# EAGLE design BrickPi 0.5 (EAGLE 6.3)
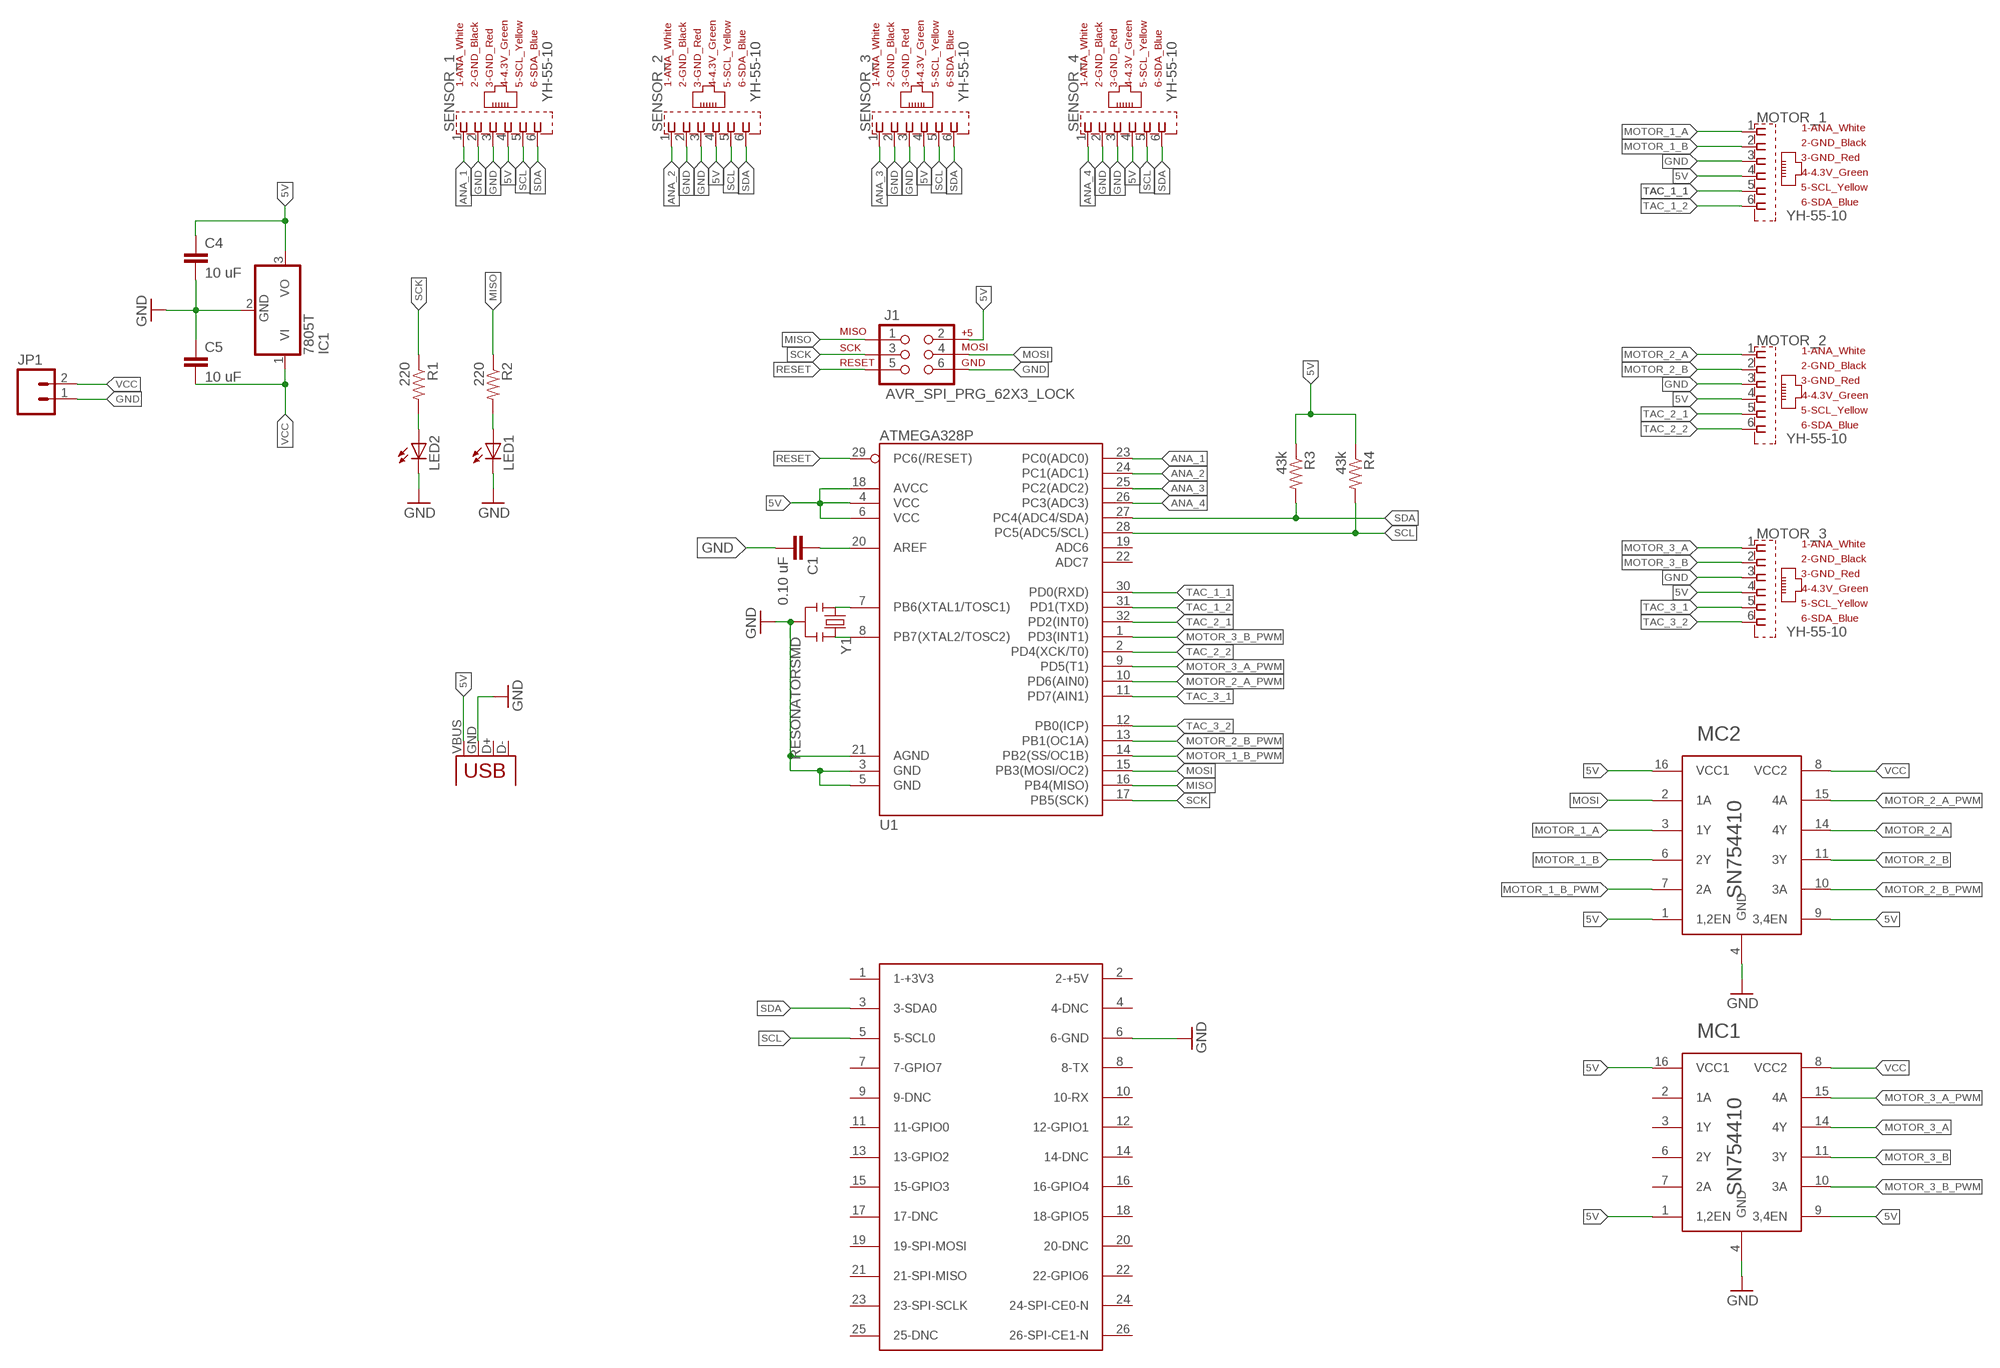
[diagram p0: schematic, sheet 1]

## Parts
C1  0.10 uF  CAP0805  [0805]
C4  10 uF  CAP0805  [0805]
C5  10 uF  CAP0805  [0805]
IC1  7805T  [TO220H]
J1  AVR_SPI_PRG_62X3_LOCK  [2X3_LOCK]
JP1  M02LOCK  [1X02_LOCK]
JP2  USB-A-H  [USB-A-H]
LED1  LED1206  [LED-1206]
LED2  LED1206  [LED-1206]
MC1  SN754410  [DIL16]
MC2  SN754410  [DIL16]
MOTOR_1  YH-55-10  [YH-55-10]
MOTOR_2  YH-55-10  [YH-55-10]
MOTOR_3  YH-55-10  [YH-55-10]
PI_OUTLINE  RASPBERRY-PI  [RASPBERRY-PI]
R1  220  220-5%  [0603-RES]
R2  220  220-5%  [0603-RES]
R3  43k  220-5%  [0603-RES]
R4  43k  220-5%  [0603-RES]
SENSOR_1  YH-55-10  [YH-55-10]
SENSOR_2  YH-55-10  [YH-55-10]
SENSOR_3  YH-55-10  [YH-55-10]
SENSOR_4  YH-55-10  [YH-55-10]
U1  ATMEGA328P  ATMEGA328_SMT  [TQFP32-08]
Y1  RESONATORSMD  [RESONATOR-SMD]

## Nets
5V [Logic_Power]: C4.1 IC1.3(VO) J1.2 JP2.VBUS(GND) MC1.1(1,2EN) MC1.9(3,4EN) MC1.16(VCC1) MC2.1(1,2EN) MC2.9(3,4EN) MC2.16(VCC1) MOTOR_1.4(4_4.3V_GREEN) MOTOR_2.4(4_4.3V_GREEN) MOTOR_3.4(4_4.3V_GREEN) R3.1 R4.1 SENSOR_1.4(4_4.3V_GREEN) SENSOR_2.4(4_4.3V_GREEN) SENSOR_3.4(4_4.3V_GREEN) SENSOR_4.4(4_4.3V_GREEN) U1.4(VCC) U1.6(VCC) U1.18(AVCC)
ANA_1: SENSOR_1.1(1_ANA_WHITE) U1.23(PC0(ADC0))
ANA_2: SENSOR_2.1(1_ANA_WHITE) U1.24(PC1(ADC1))
ANA_3: SENSOR_3.1(1_ANA_WHITE) U1.25(PC2(ADC2))
ANA_4: SENSOR_4.1(1_ANA_WHITE) U1.26(PC3(ADC3))
GND [Power]: C1.2 C4.2 C5.1 IC1.2(GND) J1.6 JP1.1 JP2.GND(VBUS) LED1.C LED2.C MC1.4(GND) MC2.4(GND) MOTOR_1.3(3_GND_RED) MOTOR_2.3(3_GND_RED) MOTOR_3.3(3_GND_RED) PI_OUTLINE.6(6-GND) SENSOR_1.2(2_GND_BLACK) SENSOR_1.3(3_GND_RED) SENSOR_2.2(2_GND_BLACK) SENSOR_2.3(3_GND_RED) SENSOR_3.2(2_GND_BLACK) SENSOR_3.3(3_GND_RED) SENSOR_4.2(2_GND_BLACK) SENSOR_4.3(3_GND_RED) U1.3(GND) U1.5(GND) U1.21(AGND) Y1.2
MISO: J1.1 R2.1 U1.16(PB4(MISO))
MOSI: J1.4 MC2.2(1A) U1.15(PB3(MOSI/OC2))
MOTOR_1_A [Power]: MC2.3(1Y) MOTOR_1.1(1_ANA_WHITE)
MOTOR_1_B [Power]: MC2.6(2Y) MOTOR_1.2(2_GND_BLACK)
MOTOR_1_B_PWM: MC2.7(2A) U1.14(PB2(SS/OC1B))
MOTOR_2_A [Power]: MC2.14(4Y) MOTOR_2.1(1_ANA_WHITE)
MOTOR_2_A_PWM: MC2.15(4A) U1.10(PD6(AIN0))
MOTOR_2_B [Power]: MC2.11(3Y) MOTOR_2.2(2_GND_BLACK)
MOTOR_2_B_PWM: MC2.10(3A) U1.13(PB1(OC1A))
MOTOR_3_A [Power]: MC1.14(4Y) MOTOR_3.1(1_ANA_WHITE)
MOTOR_3_A_PWM: MC1.15(4A) U1.9(PD5(T1))
MOTOR_3_B [Power]: MC1.11(3Y) MOTOR_3.2(2_GND_BLACK)
MOTOR_3_B_PWM: MC1.10(3A) U1.1(PD3(INT1))
N$1: U1.7(PB6(XTAL1/TOSC1)) Y1.1
N$2: U1.8(PB7(XTAL2/TOSC2)) Y1.3
N$3: LED2.A R1.2
N$4: LED1.A R2.2
N$6 [Logic_Power]: C1.1 U1.20(AREF)
RESET: J1.5 U1.29(PC6(/RESET))
SCK: J1.3 R1.1 U1.17(PB5(SCK))
SCL: PI_OUTLINE.5(5-SCL0) R4.2 SENSOR_1.5(5_SCL_YELLOW) SENSOR_2.5(5_SCL_YELLOW) SENSOR_3.5(5_SCL_YELLOW) SENSOR_4.5(5_SCL_YELLOW) U1.28(PC5(ADC5/SCL))
SDA: PI_OUTLINE.3(3-SDA0) R3.2 SENSOR_1.6(6_SDA_BLUE) SENSOR_2.6(6_SDA_BLUE) SENSOR_3.6(6_SDA_BLUE) SENSOR_4.6(6_SDA_BLUE) U1.27(PC4(ADC4/SDA))
TAC_1_1: MOTOR_1.5(5_SCL_YELLOW) U1.30(PD0(RXD))
TAC_1_2: MOTOR_1.6(6_SDA_BLUE) U1.31(PD1(TXD))
TAC_2_1: MOTOR_2.5(5_SCL_YELLOW) U1.32(PD2(INT0))
TAC_2_2: MOTOR_2.6(6_SDA_BLUE) U1.2(PD4(XCK/T0))
TAC_3_1: MOTOR_3.5(5_SCL_YELLOW) U1.11(PD7(AIN1))
TAC_3_2: MOTOR_3.6(6_SDA_BLUE) U1.12(PB0(ICP))
VCC [Power]: C5.2 IC1.1(VI) JP1.2 MC1.8(VCC2) MC2.8(VCC2)
Unconnected: JP2.D+(D-) JP2.D-(D+) MC1.2(1A) MC1.3(1Y) MC1.6(2Y) MC1.7(2A) PI_OUTLINE.1(1-+3V3) PI_OUTLINE.2(2-+5V) PI_OUTLINE.4(4-DNC) PI_OUTLINE.7(7-GPIO7) PI_OUTLINE.8(8-TX) PI_OUTLINE.9(9-DNC) PI_OUTLINE.10(10-RX) PI_OUTLINE.11(11-GPIO0) PI_OUTLINE.12(12-GPIO1) PI_OUTLINE.13(13-GPIO2) PI_OUTLINE.14(14-DNC) PI_OUTLINE.15(15-GPIO3) PI_OUTLINE.16(16-GPIO4) PI_OUTLINE.17(17-DNC) PI_OUTLINE.18(18-GPIO5) PI_OUTLINE.19(19-SPI-MOSI) PI_OUTLINE.20(20-DNC) PI_OUTLINE.21(21-SPI-MISO) PI_OUTLINE.22(22-GPIO6) PI_OUTLINE.23(23-SPI-SCLK) PI_OUTLINE.24(24-SPI-CE0-N) PI_OUTLINE.25(25-DNC) PI_OUTLINE.26(26-SPI-CE1-N) U1.19(ADC6) U1.22(ADC7)

## Power pins joined to a net without a drawn wire
GND: MC1.5(GND) MC1.12(GND) MC1.13(GND) MC2.5(GND) MC2.12(GND) MC2.13(GND)

## Library data of the parts
C1 C4 C5 = SparkFun:CAP: Capacitor Standard 0603 ceramic capacitor, and 0.1" leaded capacitor.
IC1 = linear:78*: Positive VOLTAGE REGULATOR Source: http://cache.national.com/ds/LM/LM78L05.pdf http://www.fairchildsemi.com/ds/LM/LM7805.pdf
J1 = SparkFun-Connectors:AVR_SPI_PRG_6: AVR ISP 6 Pin This is the reduced ISP connector for AVR programming. Common on Arduino. This footprint will take up less PCB space and can be used with a 10-pin to 6-pin adapter such as SKU: BOB-08508
JP1 = SparkFun-f115009:M02: Header 2 Standard 2-pin 0.1" header. Use with straight break away headers (SKU : PRT-00116), right angle break away headers (PRT-00553), swiss pins (PRT-00743), machine pins (PRT-00117), and female headers (PRT-00115). Molex polarized connector foot print use with SKU : PRT-08233 with associated crimp pins and housings.
JP2 = SparkFun-Connectors:USB: USB Connectors USB-B-PTH is fully proven SKU : PRT-00139/CONN-08278 USB-miniB is fully proven SKU : PRT-00587 USB-A-PCB is untested. USB-A-H is throughly reviewed, but untested. Spark Fun Electronics SKU : PRT-00437 USB-B-SMT is throughly reviewed, but untested. Needs silkscreen touching up. USB-A-S has not been used/tested USB-MB-H has not been used/tested USB-MICROB has been used. CONN-09505
LED1 LED2 = SparkFun-LED:LED: LEDs Standard schematic elements and footprints for 5mm, 3mm, 1206, and 0603 sized LEDs. 5mm - Spark Fun Electronics SKU : COM-00529 (and others)
MC1 MC2 = DualBridge:SN754410: Quad Half-Bridge Driver
MOTOR_1-MOTOR_3 SENSOR_1-SENSOR_4 = DEXTER INDUSTRIES NXT Female Adapter (2!!):YH-55-10: RJ11 6 connects Source:Dexter Industries LEGO MINDSTORMS NXT Female Adapter; OC_FARNELL: unknown; OC_NEWARK: unknown
PI_OUTLINE = RaspberryPi:RASPBERRY-PI: Raspberry Pi Board <http://www.raspberrypi.org/> Jacques Lagnel V1.0 (beta) 2012 Board dimension: Forum 3D model <http://www.raspberrypi.org/forum/general-discussion/mechanical-profile-3d-models?value=3d%20model&type=1&include=1&search=1&ret=all> The GPIO Connector (P1): http://elinux.org/RPi_Low-level_peripherals
R1 R2 = SparkFun-Resistors:220-5%: 220-ohm SMT 1/8W - 5% (0805) RES-07866; PROD_ID: RES-07866
R3 R4 = SparkFun-Resistors:220-5%: 220-ohm SMT 1/8W - 5% (0805) RES-07866; PROD_ID: RES-07866; VALUE: 220
U1 = SparkFun-DigitalIC:ATMEGA328_SMT: 32-Pin Atmega328 part Commonly used on Arduino compatible boards Available in QFP and QFN packages TQFP is IC-09069 QFN is non-stock; PROD_ID: IC-09069
Y1 = SparkFun-f115009:RESONATOR: Resonator Small SMD resonator. This is the itty bitty 10/20MHz resonators with built in caps. CSTCE10M0G55 and CSTCE20M0V53. Footprint has been reviewed closely but hasn't been tested yet.

## Net classes
0 DATA: width 0.254 mm, drill 0.5 mm, clearance 0.152 mm
1 Power: width 0.508 mm, drill 0.6 mm, clearance 0.152 mm
2 Logic_Power: width 0.381 mm, drill 0.6 mm, clearance 0.152 mm

## Board
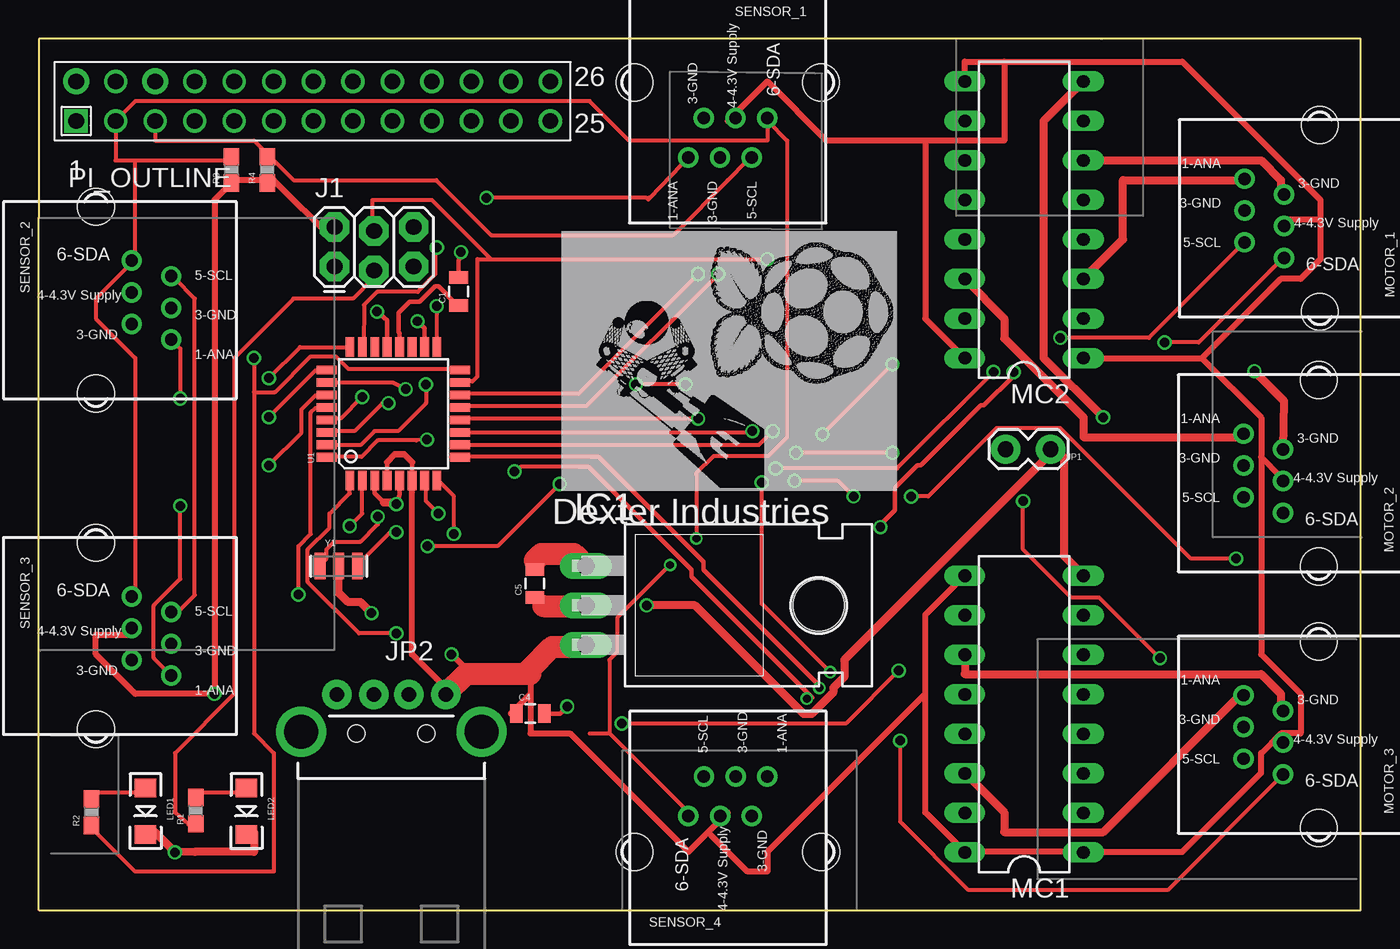
[diagram p1: board, top side]
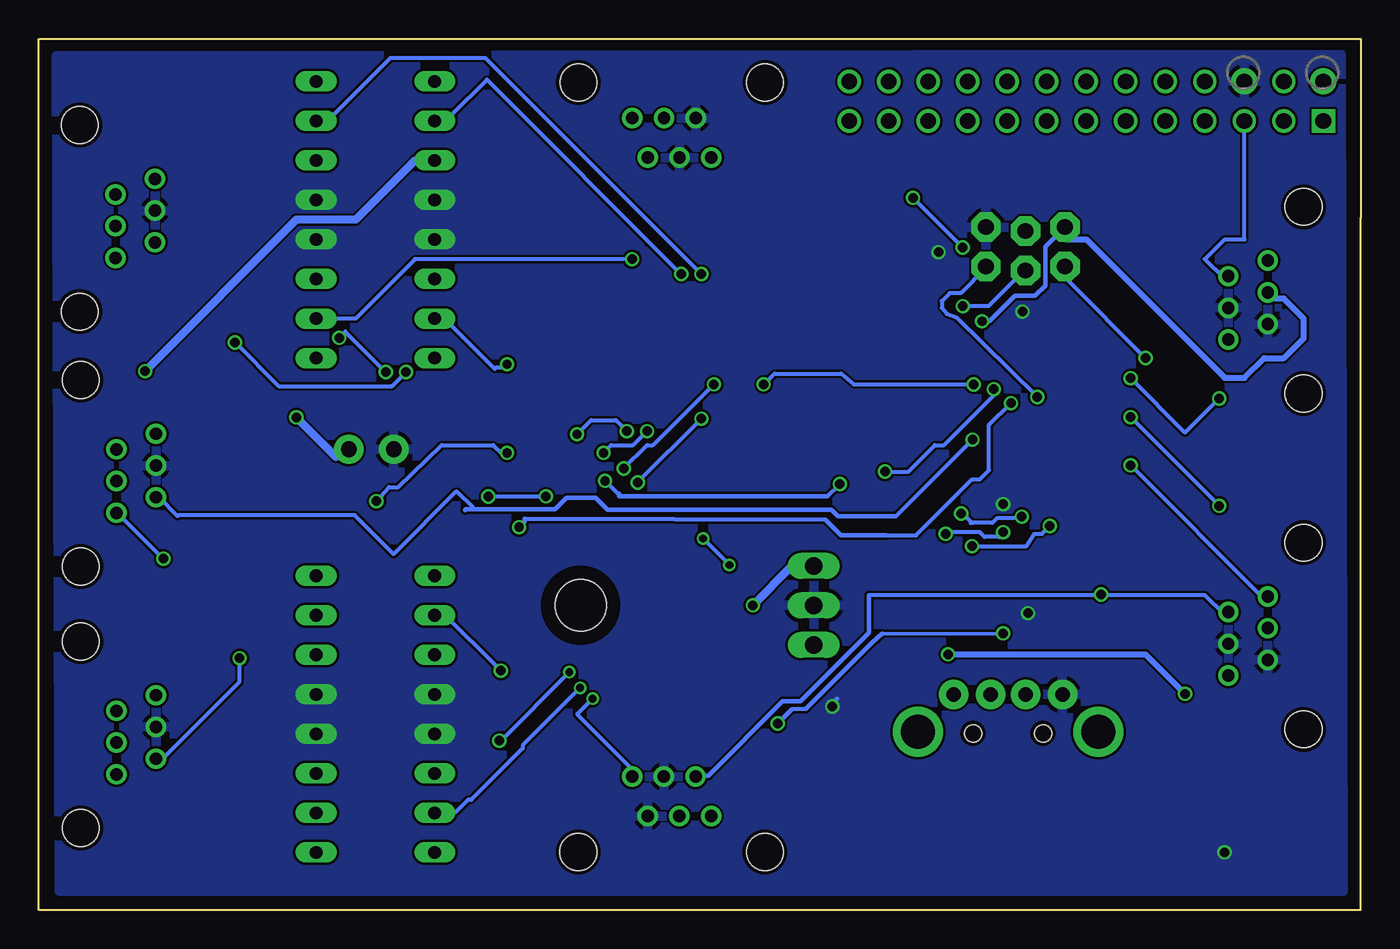
[diagram p2: board, bottom side, seen from below]

Size 85 x 56 mm. Coordinates in mm from the lower left corner, seen from the top.
Copper layers (1*16): Top 0.035mm / dielectric 1.5mm / Bottom 0.035mm
Design rules "Fusion_eagle_rule_v1.1": minimum track width 6mil, minimum drill 12mil, track to track 6mil, track to pad 6mil, pad to pad 6mil, via to via 6mil, smd to smd 0mil, copper to edge 10mil, drill to drill 10mil, minimum pad ring 10mil, minimum via ring 6mil, stop-mask expansion 2mil, vias tented up to drill 100mil, thermal gap 10mil

### Footprints (pad centres in the part's own frame; a part is rotated, then mirrored left to right if it is on the bottom)
0805 = smd 0.8 x 1.2: 1 -0.9,0; 2 0.9,0
TO220H = drill 1.118 long: 1 -2.54,-10.16; 2 0,-10.16; 3 2.54,-10.16 | hole 3.302: 0,4.826
2X3_LOCK = drill 1.016 pad 1.88 octagon: 1 0,0; 2 0,2.54; 3 2.54,-0.254; 4 2.54,2.286; 5 5.08,0; 6 5.08,2.54
1X02_LOCK = drill 1.016 pad 1.88: 1 -0.178,0; 2 2.718,0
USB-A-H = drill 0.914 pad 1.88: D+ 2.4,1.127; D- 2.4,-1.127; GND 2.4,3.5; VBUS 2.4,-3.5 | drill 2.2: GND2 0,-5.8; GND3 0,5.8 | hole 1.1: -0.1,2.25; -0.1,-2.25
LED-1206 = smd 1.2 x 1.4: A -1.5,0; C 1.5,0
DIL16 = drill 0.813 long: 1 -8.89,-3.81; 2 -6.35,-3.81; 3 -3.81,-3.81; 4 -1.27,-3.81; 5 1.27,-3.81; 6 3.81,-3.81; 7 6.35,-3.81; 8 8.89,-3.81; 9 8.89,3.81; 10 6.35,3.81; 11 3.81,3.81; 12 1.27,3.81; 13 -1.27,3.81; 14 -3.81,3.81; 15 -6.35,3.81; 16 -8.89,3.81
YH-55-10 = drill 0.8 pad 1.3: 1 2.54,4.84; 2 1.54,2.3; 3 0.5,4.84; 4 -0.5,2.3; 5 -1.54,4.84; 6 -2.54,2.3 | hole 2.36: -6,0; 6,0
RASPBERRY-PI = drill 1 square: 1 0,0 | drill 1 pad 1.676: 2 0,2.54; 6 5.08,2.54 | drill 1: 3 2.54,0; 4 2.54,2.54; 5 5.08,0; 7 7.62,0; 8 7.62,2.54; 9 10.16,0; 10 10.16,2.54; 11 12.7,0; 12 12.7,2.54; 13 15.24,0; 14 15.24,2.54; 15 17.78,0; 16 17.78,2.54; 17 20.32,0; 18 20.32,2.54; 19 22.86,0; 20 22.86,2.54; 21 25.4,0; 22 25.4,2.54; 23 27.94,0; 24 27.94,2.54; 25 30.48,0; 26 30.48,2.54
0603-RES = smd 1.1 x 1: 1 -0.85,0; 2 0.85,0
TQFP32-08 = smd 1.27 x 0.559: 1 -4.293,2.8; 2 -4.293,2; 3 -4.293,1.2; 4 -4.293,0.4; 5 -4.293,-0.4; 6 -4.293,-1.2; 7 -4.293,-2; 8 -4.293,-2.8; 17 4.293,-2.8; 18 4.293,-2; 19 4.293,-1.2; 20 4.293,-0.4; 21 4.293,0.4; 22 4.293,1.2; 23 4.293,2; 24 4.293,2.8 | smd 0.559 x 1.27: 9 -2.8,-4.293; 10 -2,-4.293; 11 -1.2,-4.293; 12 -0.4,-4.293; 13 0.4,-4.293; 14 1.2,-4.293; 15 2,-4.293; 16 2.8,-4.293; 25 2.8,4.293; 26 2,4.293; 27 1.2,4.293; 28 0.4,4.293; 29 -0.4,4.293; 30 -1.2,4.293; 31 -2,4.293; 32 -2.8,4.293
RESONATOR-SMD = smd 0.7 x 1.7: 1 -1.2,0; 2 0,0; 3 1.2,0

### Placement (x,y rotation side)
C1  26.99,39.75 90 top
C4  31.61,12.62 0 top
C5  31.89,20.98 90 top
IC1  45.33,19.58 270 top
J1  19.01,41.36 0 top
JP1  62.35,29.62 0 top
JP2  22.67,11.46 90 top
LED1  6.86,6.34 270 top
LED2  13.35,6.34 270 top
MC1  63.36,12.59 90 top
MC2  63.36,44.38 90 top
MOTOR_1  82.37,44.46 90 top
MOTOR_2  82.31,28.07 90 top
MOTOR_3  82.31,11.26 90 top
PI_OUTLINE  2.4,50.73 0 top
R1  10.09,6.38 90 top
R2  3.39,6.28 90 top
R3  12.39,47.59 90 top
R4  14.69,47.59 90 top
SENSOR_1  44.3,53.2 180 top
SENSOR_2  3.67,39.2 270 top
SENSOR_3  3.67,17.61 270 top
SENSOR_4  44.31,3.73 0 top
U1  22.8,31.91 90 top
Y1  19.28,22.1 0 top

### Tracks (layer width: path | path; a pad name or v marks a point on that pad's centre or on a via)
5V  (via drill 0.6, 0.61)
  Top 0.305: U1.4 22.39,28.78 | 23.99,28.78 U1.6 | U1.18 24.8,37.39 v24.35,37.85
  Top 0.381: 15.1,46.91 12.56,46.91 | 15.1,46.91 18.91,43.1 J1.2 | 15.1,46.91 R4.1 | 12.56,46.91 11.29,45.64 v11.29,13.89 6.21,13.89 3.67,16.43 3.67,17.7 6.21,17.7 SENSOR_3.4 | 12.56,46.91 R3.1 | U1.6 23.99,27.86 23.99,16.43 26.53,13.89 JP2.VBUS | 31.61,13.89 30.34,12.62 C4.1 | 31.61,15.16 31.61,13.89 | 43.04,5 41.77,3.73 34.15,11.35 31.61,11.35 31.61,13.89 | 43.04,5 44.31,6.27 SENSOR_4.4 | 79.87,11.35 78.6,10.08 78.6,8.81 73.52,3.73 67.17,3.73 | 67.17,3.73 59.55,3.73 | 67.17,3.73 MC1.1 | 57.01,13.89 57.01,6.27 59.55,3.73 | 57.01,13.89 57.01,18.97 59.55,21.51 MC1.9 | 59.55,3.73 MC1.16 | 78.6,29.13 79.87,27.86 MOTOR_2.4 | 78.6,29.13 78.6,31.67 74.79,35.48 | MC2.1 74.79,35.48 | 82.41,44.38 79.87,44.38 MOTOR_1.4 | 82.41,44.38 82.41,45.64 73.52,54.53 62.09,54.53 | 62.09,54.53 59.55,54.53 MC2.9 | 57.01,49.45 62.09,49.45 62.09,54.53 | 57.01,49.45 50.66,49.45 46.85,53.27 44.31,50.73 SENSOR_1.4 | MC2.16 57.01,38.02 57.01,49.45 | 74.79,35.48 79.87,40.56 81.14,40.56 82.41,41.84 82.41,44.38 | 79.87,11.35 81.14,11.35 81.14,13.89 78.6,16.43 78.6,29.13 | 79.87,11.35 MOTOR_3.4 | 43.04,5 45.58,2.46 46.85,2.46 46.85,3.73 57.01,13.89
  Top 0.406: U1.4 | 22.39,28.78 22.89,29.28 23.49,29.28 23.99,28.78 | U1.6 | v26.53,16.43 26.55,16.43 27.82,15.16
  Top 1.422: IC1.3 35.04,16.92 33.01,16.92 31.61,15.52 31.61,15.16 27.82,15.16 27.48,15.16 JP2.VBUS
  Bottom 0.305: v24.35,37.85 23.86,37.85 22.24,39.47 20.94,39.47 20.28,40.13 20.28,42.63 J1.2
  Bottom 0.381: SENSOR_2.4 6.21,39.29 4.94,39.29 3.67,38.02 3.67,36.75 4.94,35.48 6.21,35.48 7.48,34.21 8.75,34.21 17.64,43.1 18.91,43.1 J1.2 | 26.53,13.89 JP2.VBUS | v11.29,13.89 13.83,16.43 v26.53,16.43
ANA_1  (via drill 0.61)
  Top 0.254: v25.59,42.59 25.49,42.48 25.49,40.88 24.37,39.74 21.75,39.74 20.91,38.9 20.89,36.28 U1.23 | v28.79,45.78 39.09,45.78 39.19,45.68 39.19,45.78 39.29,45.78 41.29,47.88 41.69,48.28 SENSOR_1.1
  Bottom 0.254: v28.79,45.78 v25.59,42.59
ANA_2  (via drill 0.61)
  Top 0.254: v14.79,34.18 16.79,36.18 U1.24 | v9.09,32.88 9.09,36.09 SENSOR_2.1
  Bottom 0.254: v14.79,34.18 11.29,30.68 v9.09,32.88
ANA_3  (via drill 0.61)
  Top 0.254: v14.79,31.68 17.79,34.68 18.49,34.68 U1.25 | v9.09,25.98 9.09,21.28 7.39,19.58 7.39,16.18 8.49,15.08 SENSOR_3.1
  Bottom 0.254: v9.09,25.98 v14.79,31.68
ANA_4  (via drill 0.5, 0.61)
  Top 0.254: v23.59,33.48 22.79,33.88 18.59,33.88 U1.26 | 34.69,28.48 30.99,28.48 v30.59,28.18 | v49.39,13.58 49.6,13.79
  Top 0.305: 34.69,28.48 35.36,28.48 41.97,21.87 41.97,21.41 49.6,13.79 49.75,13.64
  Bottom 0.254: v30.59,28.18 29.09,28.18 27.39,29.88 26.79,29.88 23.59,33.09 v23.59,33.48 | 46.79,9.08 46.79,8.58 SENSOR_4.1 46.89,9.08 50.39,12.58 v49.39,13.58
GND  (via drill 0.6, 0.61)
  Top 0.305: 23.19,27.58 23.19,26.68 v22.99,26.08 | 21.59,27.58 21.59,26.78 22.19,26.18 | 22.39,36.28 22.39,37.9 v21.75,38.46 | C1.2 26.99,41.73 v27.14,42.29 | C4.2 33.52,12.62 v33.97,13.08
  Top 0.508: LED1.C 7.48,5 v8.75,3.7 10.02,3.73 13.83,3.73 13.83,5 LED2.C | 23.19,27.58 U1.5 | 22.19,26.18 22.59,26.18 v22.99,26.08 | 21.59,27.58 U1.3 | 22.39,36.28 U1.21 | v21.39,19.08 20.69,19.78 19.89,19.78 19.29,20.38 19.29,22.28 19.19,22.18 Y1.2
  Top 0.813: C5.1 32.45,19.53
  Top 1.422: 32.45,19.53 35.11,19.53 IC1.2
  Bottom 0.305: v27.14,42.29 27.01,42.32 27.19,42.49 | v33.97,13.08 33.97,13.28 33.67,13.59
  pour Bottom: 1.23,55 83.88,54.91 83.68,1.19 1.13,1.19
MISO  (via drill 0.61)
  Top 0.254: v13.83,35.48 13.83,33.28 | 13.83,33.28 13.83,11.35 15.1,10.08 15.1,2.46 6.21,2.46 3.67,5 R2.1 | 13.83,33.28 15.19,33.28 17.49,35.59 19.09,35.59 19.89,34.78 27.09,34.78 U1.16
  Bottom 0.254: v13.83,35.48 18.91,40.56 J1.1
MOSI  (via drill 0.61)
  Top 0.254: 29.07,41.84 28.19,41.84 28.19,34.28 27.89,33.98 27.19,33.98 U1.15 | 29.07,41.84 v46.85,41.84 | 29.07,41.84 25.26,45.64 21.45,45.64 21.45,44.38 J1.4
  Bottom 0.254: MC2.2 64.63,38.02 60.82,41.84 v46.85,41.84
MOTOR_1_A
  Top 0.508: MC2.3 69.71,43.1 69.71,46.91 77.33,46.91 MOTOR_1.1
MOTOR_1_B
  Top 0.508: MC2.6 78.6,48.18 79.87,46.91 79.87,45.64 MOTOR_1.2
MOTOR_1_B_PWM  (via drill 0.61)
  Top 0.254: v42.39,40.88 34.69,33.18 27.19,33.18 U1.14
  Bottom 0.254: v42.39,40.88 56.29,54.78 62.39,54.78 66.09,51.09 66.79,51.09 67.09,50.78 MC2.7
MOTOR_2_A
  Top 0.508: MC2.14 62.09,38.02 62.09,36.75 67.17,31.67 67.17,30.41 77.33,30.41 MOTOR_2.1
MOTOR_2_A_PWM  (via drill 0.6, 0.61)
  Top 0.254: v47.19,30.78 46.29,29.88 27.19,29.88 U1.10 | v54.89,35.09 v50.39,30.59
  Bottom 0.254: v47.19,30.78 47.89,31.48 49.49,31.48 v50.39,30.59 | v54.89,35.09 54.89,34.98 54.79,34.88 55.59,34.88 55.69,34.78 59.19,38.28 59.49,37.98 MC2.15
MOTOR_2_B  (via drill 0.6)
  Top 0.508: v78.17,34.64 80.07,32.73 MOTOR_2.2
  Bottom 0.508: v78.17,34.64 68.44,44.38 64.63,44.38 60.82,48.18 MC2.11
MOTOR_2_B_PWM  (via drill 0.61)
  Top 0.254: v43.69,40.88 35.19,32.38 27.19,32.38 U1.13
  Bottom 0.254: v43.69,40.88 56.19,53.38 58.49,51.09 59.19,51.09 MC2.10
MOTOR_3_A
  Top 0.508: MOTOR_3.1 77.33,13.89 68.44,5 62.09,5 62.09,6.27 59.55,8.81 MC1.14
MOTOR_3_A_PWM  (via drill 0.5)
  Top 0.254: 35.5,29.13 26.53,29.13 U1.9 | v50.19,14.28 50.25,14.35
  Top 0.305: 35.5,29.13 35.98,29.13 42.73,22.38 42.73,21.87 50.25,14.35 50.43,14.17
  Bottom 0.254: MC1.15 59.55,6.27 58.28,6.27 58.19,6.28 57.39,7.08 57.19,7.08 53.89,10.38 53.89,10.58 v50.19,14.28
MOTOR_3_B
  Top 0.508: MOTOR_3.2 79.87,12.62 79.87,13.89 78.6,15.16 59.55,15.16 MC1.11 59.55,16.43
MOTOR_3_B_PWM  (via drill 0.61)
  Top 0.254: v22.99,17.78 20.59,17.78 17.29,21.08 17.29,23.18 18.69,24.58 18.69,25.48 19.99,26.78 19.99,27.58 U1.1 | v37.49,11.98 51.89,11.98 v55.29,15.38
  Bottom 0.254: 30.78,17.76 v22.99,17.78 | v55.29,15.38 59.19,19.28 59.49,18.98 MC1.10
  Bottom 0.305: 30.78,17.76 31.44,17.17 35.67,12.93 36.57,12.9 v37.49,11.98
N$1  (via drill 0.61)
  Top 0.254: v25.69,25.48 24.89,26.28 24.89,27.58 U1.7 | v21.79,25.28 21.79,24.78 20.69,23.68 18.99,23.68 18.49,23.18 18.49,22.58 18.09,22.18 Y1.1
  Bottom 0.254: 24.99,24.88 23.69,24.88 23.39,25.18 21.89,25.18 v21.79,25.28 | 25.09,24.88 24.99,24.88 | 24.99,24.88 25.59,25.48 v25.69,25.48
N$2  (via drill 0.61)
  Top 0.254: v26.69,24.18 26.69,26.58 25.69,27.58 U1.8 | v22.99,24.28 22.59,24.28 20.49,22.18 Y1.3
  Bottom 0.254: v26.69,24.18 26.39,24.18 26.29,24.28 24.49,24.28 24.19,23.98 23.29,23.98 v22.99,24.28
N$3
  Top 0.254: R1.2 10.02,7.54 13.83,7.54 LED2.A
N$4
  Top 0.254: R2.2 3.67,7.54 6.21,7.54 LED1.A
N$6
  Top 0.305: U1.20 23.2,37.08 23.13,37.16 23.13,38.38 23.84,39.09 24.5,39.09 25.49,40.08 25.69,40.08 26.92,38.85 C1.1
RESET  (via drill 0.61)
  Top 0.254: v20.79,32.98 19.39,31.59 18.59,31.59 U1.29
  Bottom 0.254: v20.79,32.98 26,38.1 26.61,38.33 26.94,38.71 26.94,39.14 26.43,39.65 25.72,39.65 24.09,41.28 J1.5
SCK  (via drill 0.61)
  Top 0.254: R1.1 9.62,5.5 8.75,6.27 8.75,10.08 12.56,13.89 12.56,35.48 16.37,39.29 20.2,39.29 21.45,40.56 J1.3 | v25.59,38.82 25.59,36.98 25.59,36.28 U1.17
  Bottom 0.254: v25.59,38.82 23.93,38.82 21.78,40.97 21.49,41.09 J1.3
SCL  (via drill 0.61)
  Top 0.254: 15.1,48.18 13.83,49.45 7.48,49.45 PI_OUTLINE.5 | 15.1,48.18 16.37,46.91 25.56,46.91 29.09,43.38 40.79,43.38 40.99,43.59 44.31,46.91 45.58,48.18 SENSOR_1.5 | 15.1,48.18 R4.2 | SENSOR_2.5 8.75,40.56 10.02,39.29 10.02,20.24 8.95,19.17 SENSOR_3.5 | v16.69,20.28 16.69,23.38 17.49,24.18 17.49,31.98 17.79,32.28 18.49,32.28 U1.28
  Bottom 0.254: 16.69,20.24 10.02,20.24 8.75,18.97 SENSOR_3.5 | 16.69,20.24 31.61,20.24 | 43.04,8.81 SENSOR_4.5 | PI_OUTLINE.5 7.48,43.1 8.75,43.1 10.02,41.84 8.75,40.56 SENSOR_2.5 | v16.69,20.28 16.69,20.24
  Bottom 0.305: 31.61,20.24 31.61,17.83 36.03,13.41 37.17,13.41 41.95,8.64 42.71,8.64 SENSOR_4.5
SDA  (via drill 0.5, 0.61)
  Top 0.254: 6.21,48.18 4.94,48.18 PI_OUTLINE.3 6.21,51.99 35.42,51.99 37.96,49.45 46.85,49.45 46.85,50.73 | 6.21,48.18 12.56,48.18 R3.2 | 6.21,41.84 3.67,39.29 3.67,38.02 6.21,35.48 6.21,20.24 SENSOR_3.6 | 6.21,41.84 6.21,48.18 | 6.21,41.84 SENSOR_2.6 | 36.69,11.35 41.77,6.27 SENSOR_4.6 | 35.42,11.35 36.69,11.35 | 46.85,50.73 48.12,49.45 48.12,30.41 46.9,29.18 43.39,29.18 42.24,28.03 42.29,27.98 v42.29,23.88 | 46.85,50.73 SENSOR_1.6 | v14.79,28.58 16.89,30.68 16.89,32.18 17.79,33.09 18.49,33.09 U1.27 | v40.59,22.18 37.19,18.78 37.19,16.58 36.69,16.08 36.69,11.38 36.69,11.35
  Bottom 0.254: v14.79,28.58 6.19,19.98 5.99,20.18 SENSOR_3.6 | v42.29,23.88 v40.59,22.18
TAC_1_1  (via drill 0.6, 0.61)
  Top 0.254: v22.49,32.59 22.09,32.59 20.29,30.78 18.59,30.78 U1.30 | v65.69,36.78 71.39,36.78 MOTOR_1.5
  Top 0.305: v62.69,34.59 62.69,34.36 60.77,32.44 60.57,32.44 56.73,28.6 56.5,28.6 55.05,27.15 55.05,25.71 54.11,24.77 v54.11,24.61
  Bottom 0.254: v22.49,32.59 23.89,31.18 23.89,28.28 24.49,27.68 24.99,27.68 28.59,24.08 30.49,24.08 | v62.69,34.59 65.29,37.18 v65.69,36.78
  Bottom 0.305: 30.49,24.08 33.42,24.08 34.43,25.1 53.76,25.15 53.76,24.97 v54.11,24.61
TAC_1_2  (via drill 0.6, 0.61)
  Top 0.254: v24.89,33.78 24.89,32.59 23.09,30.78 21.59,30.78 20.69,29.88 18.59,29.88 U1.31 | v41.59,33.78 v38.39,33.78 | v47.39,28.38 55.19,28.38 v61.39,34.59 | v72.39,36.48 74.59,36.48 79.99,41.88 MOTOR_1.6
  Bottom 0.254: v38.39,33.78 37.69,34.48 33.39,34.48 32.59,33.78 v24.89,33.78 | v41.59,33.78 45.49,29.88 45.89,29.88 v47.39,28.38 | v61.39,34.59 62.29,33.68 69.59,33.68 v72.39,36.48
TAC_2_1  (via drill 0.61)
  Top 0.254: v24.96,30.23 24.29,30.18 21.79,30.18 20.74,29.13 18.91,29.13 U1.32
  Bottom 0.254: 29.87,25.32 v24.96,30.23 | MOTOR_2.5 77.33,26.59 76.06,25.32 75.99,25.38 64.69,25.38 62.19,22.88 58.19,26.88 58.09,26.88 57.09,25.88 57.09,25.76
  Bottom 0.305: 29.87,25.32 33.62,25.32 34.02,25.73 48.42,25.73 49.19,26.49 51.07,26.49 51.8,25.76 57.09,25.76 57.54,25.76 57.59,25.71
TAC_2_2  (via drill 0.6, 0.61)
  Top 0.254: v19.99,24.68 20.79,25.48 20.79,27.58 U1.2 | v24.99,23.38 29.49,23.38 v33.49,27.38 | v52.39,26.58 51.39,27.58 v48.59,27.58 | v56.09,26.58 57.19,26.58 61.59,30.98 65.69,30.98 74.09,22.58 v76.99,22.58
  Bottom 0.254: v19.99,24.68 20.49,24.18 20.99,24.18 21.49,23.38 v24.99,23.38 | v56.09,26.58 v52.39,26.58 | v48.59,27.58 47.69,26.68 | 47.69,26.68 47.69,26.78 | 47.69,26.68 47.69,26.58 | 34.29,26.58 v33.49,27.38 | v76.99,22.58 79.99,25.58 MOTOR_2.6
  Bottom 0.305: 34.29,26.58 47.69,26.58
TAC_3_1  (via drill 0.6, 0.61)
  Top 0.254: v45.89,30.78 45.79,30.68 27.19,30.68 U1.11 | v54.89,29.38 v48.69,29.38 | v63.29,26.28 63.29,23.18 66.39,20.08 68.19,20.08 v72.09,16.18
  Bottom 0.254: v45.89,30.78 46.79,29.88 48.19,29.88 v48.69,29.38 | v54.89,29.38 54.99,29.28 55.19,29.28 55.79,29.88 59.09,29.88 61.89,27.18 62.49,27.18 v63.29,26.28 | v72.09,16.18 72.09,14.68 76.89,9.88 77.29,9.88 77.39,9.78 MOTOR_3.5
TAC_3_2  (via drill 0.5, 0.61)
  Top 0.254: v42.39,31.59 27.19,31.59 U1.12 | v55.39,10.88 55.39,5.68 59.79,1.28 72.59,1.28 79.99,8.68 MOTOR_3.6 | v50.89,15.28 46.49,19.68 46.49,27.38 v46.49,27.48
  Bottom 0.254: v46.49,27.48 v42.39,31.59 | v50.89,15.28 55.29,10.88 v55.39,10.88
VCC  (via drill 0.6, 0.61)
  Top 0.508: MC1.8 67.17,21.51 65.9,22.78 65.9,29.13 JP1.2 | MC2.8 64.63,50.73 64.63,35.48 v68.44,31.67 | 64.63,29.13 JP1.2 | v39.09,19.58 42.19,19.58 49.19,12.58 49.69,12.58 51.09,13.98 51.09,14.28 51.79,14.98 51.79,16.08 64.59,28.88 JP1.2
  Top 0.813: C5.2 31.89,22.45
  Top 1.422: 31.89,22.45 32.32,22.89 34.4,22.89 IC1.1
  Bottom 0.508: v68.44,31.67 65.9,29.13 JP1.2 | v39.09,19.58 36.59,22.08 35.19,22.08 IC1.1

### Text on the board
tNames: Dexter Industries